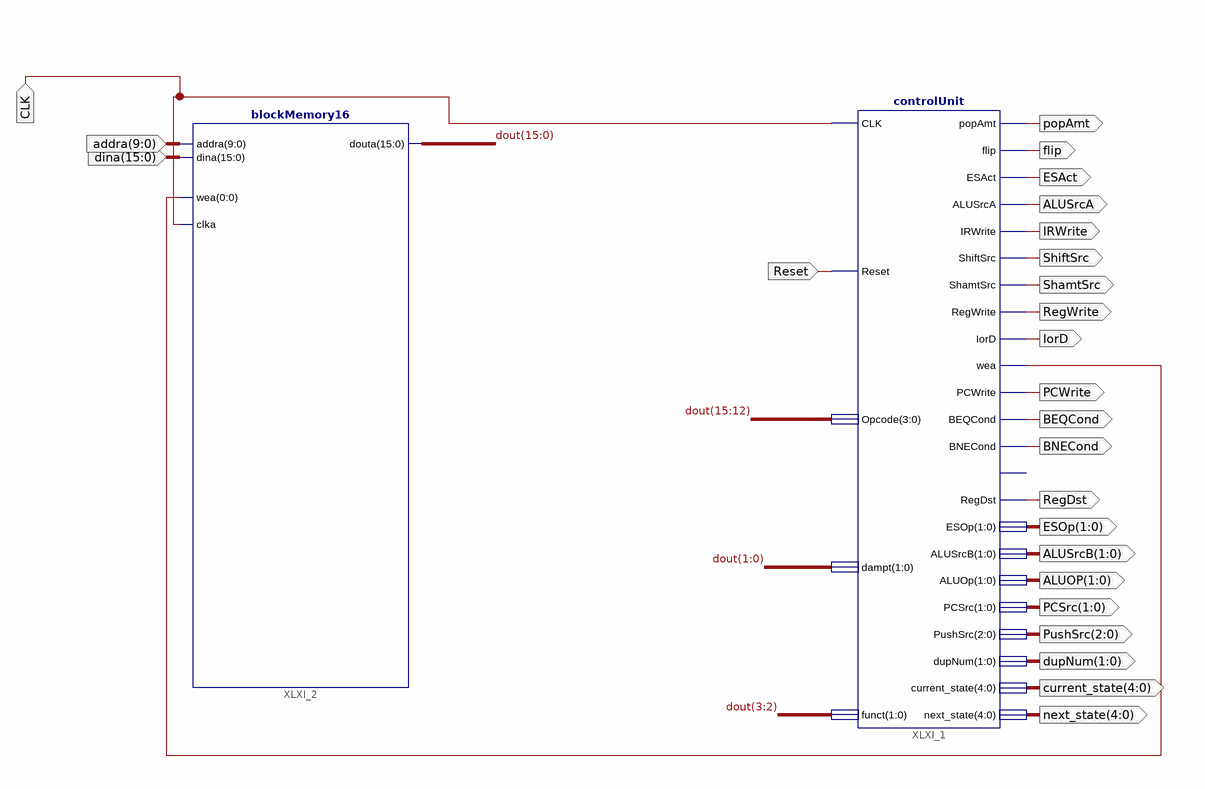
[diagram p0: schematic sheet 1]
// Xilinx ISE schematic MemoryandControl.sch (spartan3e) as structural Verilog: 2 symbols, 25 ports
module MemoryandControl (
  input  Reset,
  input  [15:0] dina,
  input  [9:0] addra,
  input  CLK,
  output popAmt,
  output flip,
  output ESAct,
  output ALUSrcA,
  output IRWrite,
  output ShiftSrc,
  output ShamtSrc,
  output RegWrite,
  output IorD,
  output PCWrite,
  output BEQCond,
  output BNECond,
  output RegDst,
  output [1:0] ESOp,
  output [1:0] ALUSrcB,
  output [1:0] ALUOP,
  output [1:0] PCSrc,
  output [2:0] PushSrc,
  output [1:0] dupNum,
  output [4:0] current_state,
  output [4:0] next_state
);

  wire wea;
  wire [15:0] dout;

  controlUnit XLXI_1 (
    .CLK(CLK), .Reset(Reset), .Opcode(dout[15:12]), .dampt(dout[1:0]), .funct(dout[3:2]), .popAmt(popAmt),
    .flip(flip), .ESAct(ESAct), .ALUSrcA(ALUSrcA), .IRWrite(IRWrite), .ShiftSrc(ShiftSrc),
    .ShamtSrc(ShamtSrc), .RegWrite(RegWrite), .IorD(IorD), .wea(wea), .PCWrite(PCWrite), .BEQCond(BEQCond),
    .BNECond(BNECond), .RegDst(RegDst), .ESOp(ESOp), .ALUSrcB(ALUSrcB), .ALUOp(ALUOP), .PCSrc(PCSrc),
    .PushSrc(PushSrc), .dupNum(dupNum), .current_state(current_state), .next_state(next_state));
  blockMemory16 XLXI_2 (.addra(addra), .dina(dina), .wea(wea), .clka(CLK), .douta(dout));
endmodule
